# EasyEDA Pro project esp-streamer-pcb.epro

# Board PCB1
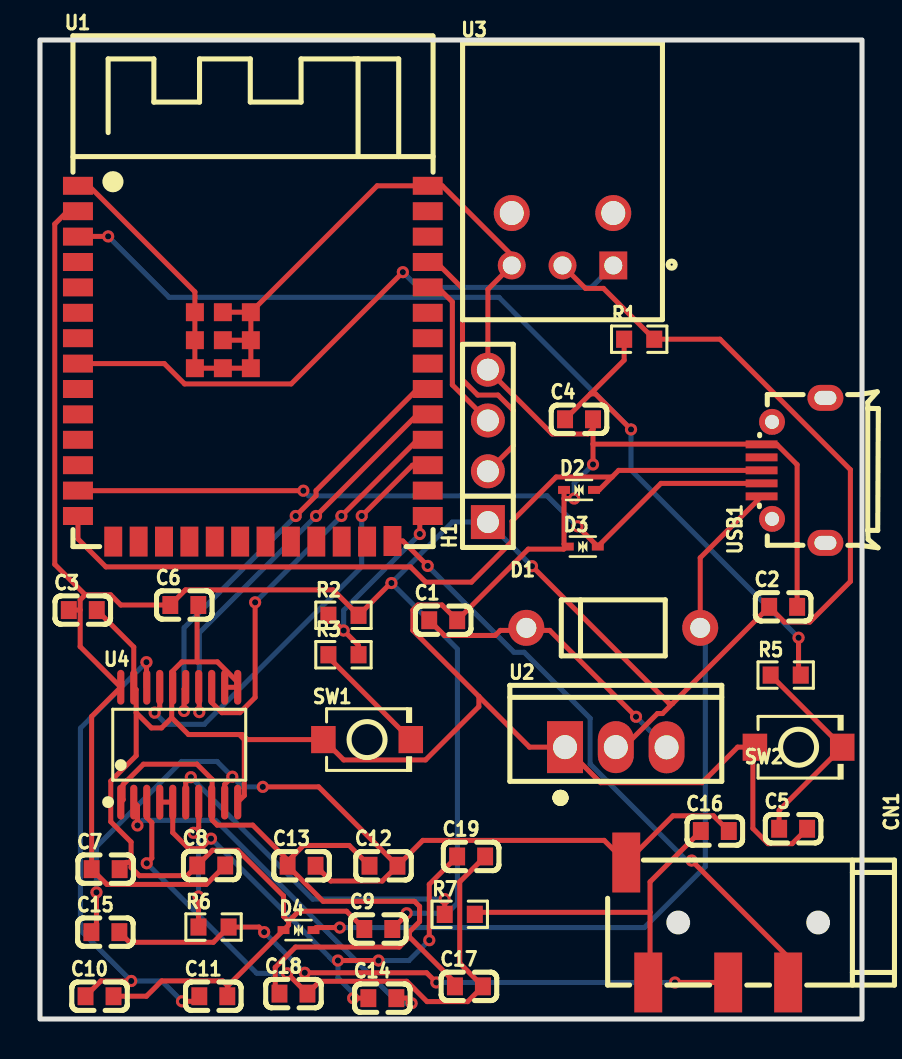
[diagram p0: board, top side]
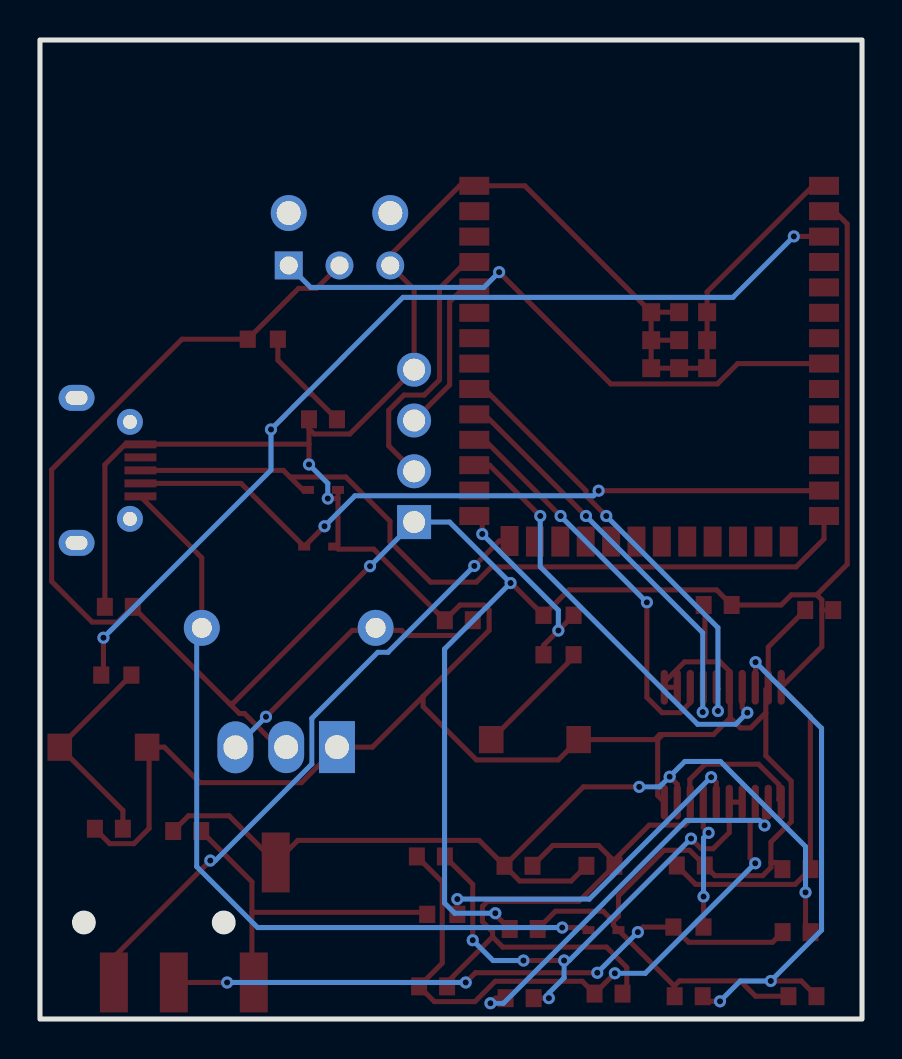
[diagram p1: board, bottom side, seen from below]

Outline 41.13 x 48.95 mm; copper layers: Top Layer, Bottom Layer. Coordinates in mm from the lower left corner of the outline.
Outline path: rectangle 0,48.95 41.13,0
Stack: Top Layer 0.035mm / Dielectric1 1.51mm FR4 er 4.5 / Bottom Layer 0.035mm

## Design rules (mm)
template: JLCPCB Capability(Two Layers Board)
spacing copperThickness1oz (default): track to track 0.102, other pairs 0.152 to 0.3
spacing copperThickness2oz: track to track 0.203, other pairs 0.152 to 0.3
track width copperThickness1oz (default): min 0.127, default 0.254, max 2.54
track width copperThickness2oz: min 0.203, default 0.254, max 2.54
differential pair differentialPair (default): width min 0.127, default 0.254, max 2.54; gap min 0.152, default 0.152
via viaSize (default): diameter min 0.5, default 0.61, max 10; hole min 0.3, default 0.305, max 6.3

## Placement (name value [footprint] x y rotation side)
C1  10uF  [C0603]  20.18 19.94 0 top
C2  22uF  [C0603]  37.18 20.61 0 top
C3  22uF  [C0603]  2.14 20.45 0 top
C4  1uF  [C0603]  26.97 29.99 0 top
C5  100nF  [C0603]  37.68 9.51 0 top
C6  100nF  [C0603]  7.22 20.7 0 top
C7  100nF  [C0603]  3.29 7.49 0 top
C8  10uF  [C0603]  8.57 7.67 0 top
C9  0.1uF  [C0603]  16.93 4.5 0 top
C10  10uF  [C0603]  2.98 1.14 0 top
C11  0.1uF  [C0603]  8.67 1.14 0 top
C12  10uF  [C0603]  17.19 7.66 0 top
C13  0.1uF  [C0603]  13.09 7.66 0 top
C14  2.2uF  [C0603]  17.13 1.04 0 top
C15  2.2nF  [C0603]  3.27 4.34 0 top
C16  2.2nF  [C0603]  33.77 9.4 0 top
C17  10uF  [C0603]  21.46 1.63 0 top
C18  0.1uF  [C0603]  12.68 1.27 0 top
C19  2.2uF  [C0603]  21.57 8.13 0 top
CN1  PJ-320D  [AUDIO-SMD_PJ-320D]  33.38 4.83 270 top
D1  1N4007  [DO-41_BD2.4-L4.7-P8.70-D0.9-RD]  28.69 19.56 0 top
D2  LESD5D5.0CT1G  [SOD-523_L1.2-W0.8-LS1.6-BI]  26.97 26.45 0 top
D3  LESD5D5.0CT1G  [SOD-523_L1.2-W0.8-LS1.6-BI]  27.16 23.62 0 top
D4  LESD5D5.0CT1G  [SOD-523_L1.2-W0.8-LS1.6-BI]  12.94 4.44 0 top
H1  PZ254V-11-04P  [HDR-TH_4P-P2.54-V-M]  22.41 28.66 90 top
R1  10kΩ  [R0603]  29.98 33.99 0 top
R2  10kΩ  [R0603]  15.19 20.19 0 top
R3  470Ω  [R0603]  15.19 18.21 0 top
R5  470Ω  [R0603]  37.31 17.2 0 top
R6  470  [R0603]  8.68 4.6 0 top
R7  470  [R0603]  21 5.23 0 top
SW1  TS-1088-AR02016  [SW-SMD_L3.9-W3.0-P4.45]  16.37 13.97 0 top
SW2  TS-1088-AR02016  [SW-SMD_L3.9-W3.0-P4.45]  37.96 13.59 0 top
U1  ESP32-S3-WROOM-1-N8R8  [WIRELM-SMD_ESP32-S3-WROOM-1]  10.65 32.77 0 top
U2  LM1117T-3.3  [TO-220-3_L10.0-W4.5-P2.54-L]  28.81 13.59 0 top
U3  ZGY133/T10(PLT)  [COMM-TH_ZGY133-T10-PLT]  26.15 38.99 0 top
U4  PCM5102APWR  [TSSOP-20_L6.5-W4.4-P0.65-LS6.4-BL]  6.97 13.72 0 top
USB1  MicroXNJ  [MICRO-USB-SMD_MICROXNJ]  37.7 27.43 90 top

## Footprints (pads in the part's own frame, mm; a bottom-side part is the same pattern mirrored in y, then rotated)
AUDIO-SMD_PJ-320D
  rect 3x1.4 smd: 1(-3,-4.05) 2(3,4.05) 3(3,1.05) 4(3,-2.95)
C0603
  rect 0.8x0.9 smd: 1(-0.7,0) 2(0.7,0)
COMM-TH_ZGY133-T10-PLT
  rect 1.4x1.4 hole 0.9: 1(2.54,-1.31)
  round 1.4 hole 0.9: 2(0,-1.31) 3(-2.54,-1.31)
  round 1.8 hole 1.2: 4(2.54,1.31) 5(-2.54,1.31)
DO-41_BD2.4-L4.7-P8.70-D0.9-RD
  round 1.8 hole 1: 1(-4.35,0) 2(4.35,0)
HDR-TH_4P-P2.54-V-M
  rect 1.7x1.7 hole 1.1: 1(-3.81,0)
  round 1.7 hole 1.1: 2(-1.27,0) 3(1.27,0) 4(3.81,0)
MICRO-USB-SMD_MICROXNJ
  rect 0.4x1.6 smd: 1(-1.3,1.597) 2(-0.65,1.597) 3(0,1.597) 4(0.65,1.597) 5(1.3,1.597)
  round 1.3 hole 0.7: 6(2.425,1.074) 9(-2.425,1.073)
  oval 1.3x1.8 hole 0.7x1.1: 7(3.625,-1.597) 8(-3.625,-1.597)
R0603
  rect 0.806x0.864 smd: 1(-0.753,0) 2(0.753,0)
SOD-523_L1.2-W0.8-LS1.6-BI
  rect 0.6x0.4 smd: 1(-0.75,0) 2(0.75,0)
SW-SMD_L3.9-W3.0-P4.45
  rect 1.23x1.36 smd: 1(-2.185,0) 2(2.185,0)
TO-220-3_L10.0-W4.5-P2.54-L
  rect 1.8x2.6 hole 1.2: 1(-2.54,0.005)
  oval 1.8x2.6 hole 1.2: 2(0,0.005) 3(2.54,-0.005)
TSSOP-20_L6.5-W4.4-P0.65-LS6.4-BL
  oval 0.364x1.742 smd: 1(-2.925,-2.871) 2(-2.275,-2.871) 3(-1.625,-2.871) 4(-0.975,-2.871) 5(-0.325,-2.871) 6(0.325,-2.871) 7(0.975,-2.871) 8(1.625,-2.871) 9(2.275,-2.871) 10(2.925,-2.871) 11(2.925,2.871) 12(2.275,2.871) 13(1.625,2.871) 14(0.975,2.871) 15(0.325,2.871) 16(-0.325,2.871) 17(-0.975,2.871) 18(-1.625,2.871) 19(-2.275,2.871) 20(-2.925,2.871)
WIRELM-SMD_ESP32-S3-WROOM-1
  rect 1.5x0.9 smd: 1(-8.75,8.895) 2(-8.75,7.625) 3(-8.75,6.355) 4(-8.75,5.085) 5(-8.75,3.815) 6(-8.75,2.545) 7(-8.75,1.275) 8(-8.75,0.005) 9(-8.75,-1.265) 10(-8.75,-2.535) 11(-8.75,-3.805) 12(-8.75,-5.075) 13(-8.75,-6.345) 14(-8.75,-7.615) 27(8.75,-7.615) 28(8.75,-6.345) 29(8.75,-5.075) 30(8.75,-3.805) 31(8.75,-2.535) 32(8.75,-1.265) 33(8.75,0.005) 34(8.75,1.275) 35(8.75,2.545) 36(8.75,3.815) 37(8.75,5.085) 38(8.75,6.355) 39(8.75,7.625) 40(8.75,8.895)
  rect 0.9x1.5 smd: 15(-6.985,-8.895) 16(-5.715,-8.895) 17(-4.445,-8.895) 18(-3.175,-8.895) 19(-1.905,-8.895) 20(-0.635,-8.895) 21(0.635,-8.895) 22(1.905,-8.895) 23(3.175,-8.895) 24(4.445,-8.895) 25(5.715,-8.895) 26(6.985,-8.865)
  rect 0.9x0.9 smd: 41(-2.9,2.575) 41(-2.9,1.175) 41(-2.9,-0.225) 41(-1.5,2.575) 41(-1.5,1.175) 41(-1.5,-0.225) 41(-0.1,2.575) 41(-0.1,1.175) 41(-0.1,-0.225)

## Nets
+5V: C1.1 D1.1 U2.3
AGND: C12.2 C13.2 C15.1 C16.2 CN1.1 U4.9
AVCC: C12.1 C13.1 C17.1 C18.1 U4.1 U4.8
GND: C1.2 C2.2 C3.2 C4.2 C5.2 C6.2 C7.2 C8.1 C9.1 C10.2 C11.2 D2.1 D3.1 D4.1 H1.4 SW1.1 SW2.1 U1.1 U1.40 U1.41 U2.1 U3.3 U4.10 U4.11 U4.12 U4.16 U4.19 USB1.5
VCC: C2.1 C3.1 C6.1 C7.1 C8.2 C9.2 H1.1 R1.2 R2.2 U1.2 U2.2 U3.2 U4.20
BOOT: R2.1 R3.2 U1.27
EN: C4.1 R1.1 R5.2 U1.3
I2S_BCK: U1.30 U4.13
I2S_DIN: U1.31 U4.14
I2S_LRCK: U1.32 U4.15
MUTE: U1.29 U4.17
PLUGGED: CN1.2 U1.26
TOSLINK: U1.8 U3.1
USB+: D2.2 U1.14 USB1.3
USB-: D3.2 U1.13 USB1.2
$1N1748: R3.1 SW1.2
$1N1952: C5.1 R5.1 SW2.2
$1N2152: H1.2 U1.37
$1N2156: H1.3 U1.36
$1N2265: D1.2 D4.2 USB1.1
$1N5599: C10.1 C11.1 U4.18
$1N6006: C14.1 C19.1 U4.4 U4.5
$1N6011: C14.2 U4.2
$1N6092: R6.1 U4.7
$1N6096: R7.1 U4.6
$1N6124: C15.2 CN1.3 R6.2
$1N6150: C16.1 CN1.4 R7.2
$1N6258: C17.2 C18.2 C19.2 U4.3

Pads without a net: U1 4 5 6 7 9 10 11 12 15 16 17 18 19 20 21 22 23 24 25 28 33 34 35 38 39; U3 4 5; USB1 4 6 7 8 9

## Via types
v1: diameter 0.61, hole 0.305, Top Layer to Bottom Layer, 48 vias

## Routing (per net, layer and track width the routed paths; a pad name or vN(x,y) marks a point on that pad's centre or on a via; arc(x,y) is an arc through that point)
+5V: length 14.9
  Top Layer w0.254: v1(29.82,15.11) 25.51,19.43 24.21,19.43 ; 24.21,19.43 D1.1 ; 24.21,19.43 23.03,19.43 22.78,19.18 20.24,19.18 C1.1
  Bottom Layer w0.254: v1(29.82,15.11) U2.3
AGND: length 48.4
  Top Layer w0.254: v1(2.83,6.33) 2.83,4.6 C15.1 ; v1(11.15,11.61) 13.94,11.61 C12.2 ; C16.2 33.7,10.16 31.67,10.16 CN1.1 28.23,8.93 19.16,8.93 C12.2 ; C12.2 17.13,6.9 14.55,6.9 C13.2 ; v1(9.62,12.11) 9.24,11.73 U4.9
  Bottom Layer w0.254: v1(11.15,11.61) 10.13,11.61 v1(9.62,12.11) 8.86,12.88 7.08,12.88 2.83,8.62 v1(2.83,6.33)
AVCC: length 39.3
  Top Layer w0.254: 8.61,10.71 8.61,9.95 8.87,9.69 10.65,9.69 12.42,7.92 ; 8.61,10.71 8.61,11.98 7.85,12.74 5.18,12.74 4.16,11.73 4.16,10.96 U4.1 ; 8.61,10.71 U4.8 ; 20.76,1.63 20.76,1.83 18.49,4.11 ; 18.49,4.11 17.98,3.6 12.79,3.6 11.77,2.58 11.77,1.48 C18.1 ; 18.49,4.11 18.49,4.36 18.99,4.87 18.99,5.63 18.74,5.88 14.17,5.88 C13.1 12.42,7.92 ; 12.42,7.92 13.19,8.68 15.47,8.68 C12.1
GND: length 190.2
  Top Layer w0.254: 26.22,26.02 v1(26.73,26.02) ; 26.22,26.02 26.22,23.74 26.34,23.62 ; 26.22,26.02 D2.1 ; C6.2 7.86,20.64 7.86,17.86 ; 6.59,15.06 6.08,14.55 5.58,14.55 4.81,15.32 ; 6.59,15.06 6.59,17.35 7.1,17.86 7.86,17.86 ; 6.59,15.06 7.43,14.22 9.97,14.22 ; U1.41 U1.41 ; U1.41 U1.41 ; U1.41 16.87,41.66 U1.40 20.13,41.66 23.61,38.19 U3.3 22.41,36.48 H1.4 25.63,29.25 27.42,29.25 27.67,29.51 ; C5.2 37.64,8.77 36.43,8.77 35.67,9.53 35.67,13.59 ; 37.88,20.61 37.88,27.72 36.87,28.73 USB1.5 36.09,28.74 27.67,28.74 ; v1(27.67,27.73) 27.67,28.74 ; 27.67,28.74 27.67,29.51 ; 4.81,15.32 4.81,13.16 3.54,11.89 3.54,9.86 4.56,8.85 4.56,7.83 ; 4.81,15.32 4.81,16.47 U4.19 4.69,18.6 C3.2 ; 21.96,16.13 21.96,15.62 19.29,12.95 15.2,12.95 SW1.1 10.37,13.97 10.12,14.22 9.97,14.22 ; 21.96,16.13 18.66,19.43 18.66,20.45 18.91,20.7 20.11,20.7 C1.2 24.43,23.49 26.21,23.49 26.34,23.62 ; 21.96,16.13 24.49,13.59 U2.1 28.05,11.82 33.13,11.82 34.91,13.59 35.67,13.59 ; 12.44,4.88 12.44,4.7 D4.1 9.39,1.65 ; 12.44,4.88 12.19,5.13 12.19,6.15 9.9,8.44 8.63,8.44 C8.1 7.36,7.17 4.97,7.17 4.56,7.58 4.56,7.83 ; 12.44,4.88 12.95,5.39 15.34,5.39 C9.1 ; 35.67,13.59 SW2.1 ; U1.41 U1.41 ; U1.41 U1.41 U1.41 U1.41 U1.41 U1.41 7.75,36.36 2.45,41.66 U1.1 ; 27.67,29.51 C4.2 ; 4.56,7.83 4.32,7.83 C7.2 ; 9.39,1.65 9.14,1.9 6.09,1.9 5.33,1.14 C10.2 ; 9.39,1.65 9.39,1.16 C11.2 ; 9.97,14.22 10.22,13.97 10.22,11.18 U4.10 ; 7.86,17.86 8.88,17.86 9.89,16.84 U4.11 U4.12 ; 26.34,23.62 D3.1
  Bottom Layer w0.254: v1(27.67,27.73) 26.73,26.79 v1(26.73,26.02)
VCC: length 141.2
  Top Layer w0.254: C9.2 18.35,5.22 v1(18.35,5.29) ; v1(24.62,22.64) 31.48,15.78 31.66,15.78 ; 2.27,21.21 2.01,20.95 2.01,20.45 ; 2.27,21.21 3.54,21.21 4.04,20.7 C6.1 7.28,21.46 14.67,21.46 15.94,20.19 17.55,21.8 v1(17.59,21.8) ; 2.27,21.21 0.74,22.73 0.74,39.75 1.38,40.39 U1.2 ; 2.01,20.45 1.44,20.45 ; 2.01,20.45 2.01,18.62 U4.20 2.59,15.13 C7.1 3.35,6.73 8.32,6.73 C8.2 ; U2.2 29.22,13.59 30.9,15.27 31.15,15.27 31.66,15.78 ; 31.66,15.78 C2.1 37.25,19.85 38.52,19.85 40.55,21.88 40.55,27.47 34.02,33.99 R1.2 28.2,36.53 27.29,36.53 U3.2
  Bottom Layer w0.254: v1(24.62,22.64) H1.1 20.63,24.85 v1(17.59,21.8) 20.89,18.5 20.89,5.8 20.38,5.29 v1(18.35,5.29)
BOOT: length 10.1
  Top Layer w0.254: R2.1 v1(15.19,19.42) 15.94,18.68 15.94,18.21 ; v1(19,24.25) 19,24.75 U1.27
  Bottom Layer w0.254: v1(15.19,19.42) 15.19,20.44 v1(19,24.25)
EN: length 55.5
  Top Layer w0.254: 27.54,31.26 29.23,32.94 R1.1 ; 27.54,31.26 C4.1 ; 27.54,31.26 27.8,31.26 v1(29.57,29.48) ; R5.2 37.96,17.31 v1(37.96,19.06) ; U1.3 1.91,39.13 v1(3.41,39.13)
  Bottom Layer w0.254: v1(37.96,19.06) 29.57,27.45 v1(29.57,29.48) 22.97,36.08 6.46,36.08 v1(3.41,39.13)
I2S_BCK: length 20.2
  Top Layer w0.254: U1.30 18.89,28.96 v1(15.08,25.15) ; U4.13 8.59,15.82 9.1,15.32 10,15.32 10.77,16.08 v1(10.77,20.83)
  Bottom Layer w0.254: v1(15.08,25.15) v1(10.77,20.83)
I2S_DIN: length 21.2
  Top Layer w0.254: U1.31 18.89,30.23 v1(13.81,25.15) ; U4.14 7.97,16.56 v1(7.97,15.34)
  Bottom Layer w0.254: v1(13.81,25.15) 7.97,19.31 v1(7.97,15.34)
I2S_LRCK: length 22.7
  Top Layer w0.254: v1(12.8,25.15) 13.81,26.17 13.81,26.42 18.89,31.5 U1.32 ; U4.15 7.21,16.5 v1(7.21,15.4)
  Bottom Layer w0.254: v1(7.21,15.4) 7.21,19.56 v1(12.8,25.15)
MUTE: length 22.1
  Top Layer w0.254: U4.17 5.99,15.57 v1(5.74,15.32) ; v1(16.1,25.15) 18.64,27.69 U1.29
  Bottom Layer w0.254: v1(5.74,15.32) 6.32,14.74 8.23,14.74 16.1,22.61 v1(16.1,25.15)
PLUGGED: length 31
  Top Layer w0.254: v1(32.61,7.92) 37.43,3.1 CN1.2 ; U1.26 18.15,23.9 v1(19.4,22.65)
  Bottom Layer w0.254: v1(19.4,22.65) 23.72,18.34 24.23,18.34 27.53,15.03 27.53,12.75 32.35,7.92 v1(32.61,7.92)
TOSLINK: length 30.3
  Top Layer w0.254: U1.8 6.22,32.77 7.24,31.75 12.57,31.75 v1(18.16,37.34)
  Bottom Layer w0.254: U3.1 27.59,36.58 18.92,36.58 v1(18.16,37.34)
USB+: length 40.3
  Top Layer w0.254: 28.62,27.1 25.83,27.1 23.62,24.89 23.62,23.88 21.59,21.84 19.3,21.84 18.54,22.61 3.3,22.61 1.9,24 U1.14 ; 28.62,27.1 27.98,26.45 D2.2 ; 28.62,27.1 28.95,27.43 USB1.3
USB-: length 36.7
  Top Layer w0.254: USB1.2 31.07,26.78 D3.2 v1(26.9,24.64) ; v1(13.18,26.42) 1.91,26.42
  Bottom Layer w0.254: v1(26.9,24.64) 25.37,26.16 13.43,26.16 v1(13.18,26.42)
$1N1748: length 5.9
  Top Layer w0.254: R3.1 14.43,18.09 SW1.2
$1N1952: length 10.5
  Top Layer w0.254: C5.1 36.98,10.43 SW2.2 40.14,13.61 R5.1
$1N2152: length 13.6
  Top Layer w0.254: U1.37 19.82,37.85 21.14,36.53 21.14,31.96 21.9,31.2 22.92,31.2 23.68,30.43 23.68,28.66 H1.2
$1N2156: length 8.2
  Top Layer w0.254: U1.36 19.91,36.58 20.63,35.86 20.63,31.7 H1.3
$1N2265: length 40.8
  Top Layer w0.254: D4.2 13.81,4.57 v1(15,4.57) ; USB1.1 33.04,23.06 D1.2
  Bottom Layer w0.254: v1(15,4.57) 30.24,4.57 33.29,7.62 33.29,19.3 D1.2
$1N5599: length 26.2
  Top Layer w0.254: v1(4.57,1.9) 3.04,1.9 C10.1 ; v1(7.11,0.88) 7.72,0.88 C11.1 ; v1(5.33,17.84) 5.33,16.6 U4.18
  Bottom Layer w0.254: v1(7.11,0.88) 6.09,1.9 v1(4.57,1.9) 2.03,4.44 2.03,14.54 v1(5.33,17.84)
$1N6006: length 26.2
  Top Layer w0.254: C14.1 v1(15.67,1.04) ; v1(14.91,2.92) v1(16.94,2.92) ; C19.1 19.48,6.73 v1(19.48,3.94) ; U4.4 U4.5 6.64,9.32 7.45,8.51 8.05,8.51 v1(8.56,9.02)
  Bottom Layer w0.254: v1(16.94,2.92) 18.46,2.92 v1(19.48,3.94) ; v1(8.56,9.02) 14.65,2.92 v1(14.91,2.92) 14.91,2.06 15.67,1.3 v1(15.67,1.04)
$1N6011: length 19.7
  Top Layer w0.254: v1(4.88,9.68) 4.88,10.66 U4.2 ; v1(18.59,0.79) 18.34,1.04 C14.2
  Bottom Layer w0.254: v1(18.59,0.79) 17.94,0.79 8.79,9.93 5.13,9.93 v1(4.88,9.68)
$1N6092: length 6.5
  Top Layer w0.254: v1(7.68,9.31) 7.94,9.57 U4.7 ; R6.1 v1(7.93,6.12)
  Bottom Layer w0.254: v1(7.93,6.12) 7.93,9.05 v1(7.68,9.31)
$1N6096: length 17.3
  Top Layer w0.254: U4.6 7.29,11.83 v1(7.55,12.09) ; R7.1 v1(20.25,5.99)
  Bottom Layer w0.254: v1(20.25,5.99) 13.65,5.99 v1(7.55,12.09)
$1N6124: length 32.1
  Top Layer w0.254: v1(19.83,1.83) 19.34,2.31 v1(13.25,2.31) ; v1(11.22,4.34) 10.96,4.6 R6.2 8.68,3.84 4.48,3.84 C15.2 ; v1(31.77,1.83) CN1.3
  Bottom Layer w0.254: v1(11.22,4.34) v1(13.25,2.31) ; v1(19.83,1.83) v1(31.77,1.83)
$1N6150: length 17.5
  Top Layer w0.254: R7.2 21.86,5.33 30.53,5.33 ; C16.1 30.53,6.86 30.53,5.33 ; 30.53,5.33 30.53,1.92 CN1.4
$1N6258: length 31.3
  Top Layer w0.254: v1(5.34,7.79) 5.6,8.04 5.6,9.82 5.34,10.07 U4.3 ; C19.2 21,6.86 21,2.79 C17.2 21.4,0.87 19.37,0.87 18.35,1.89 14,1.89 C18.2 v1(12.37,2.29)
  Bottom Layer w0.254: v1(5.34,7.79) 10.84,2.29 v1(12.37,2.29)
